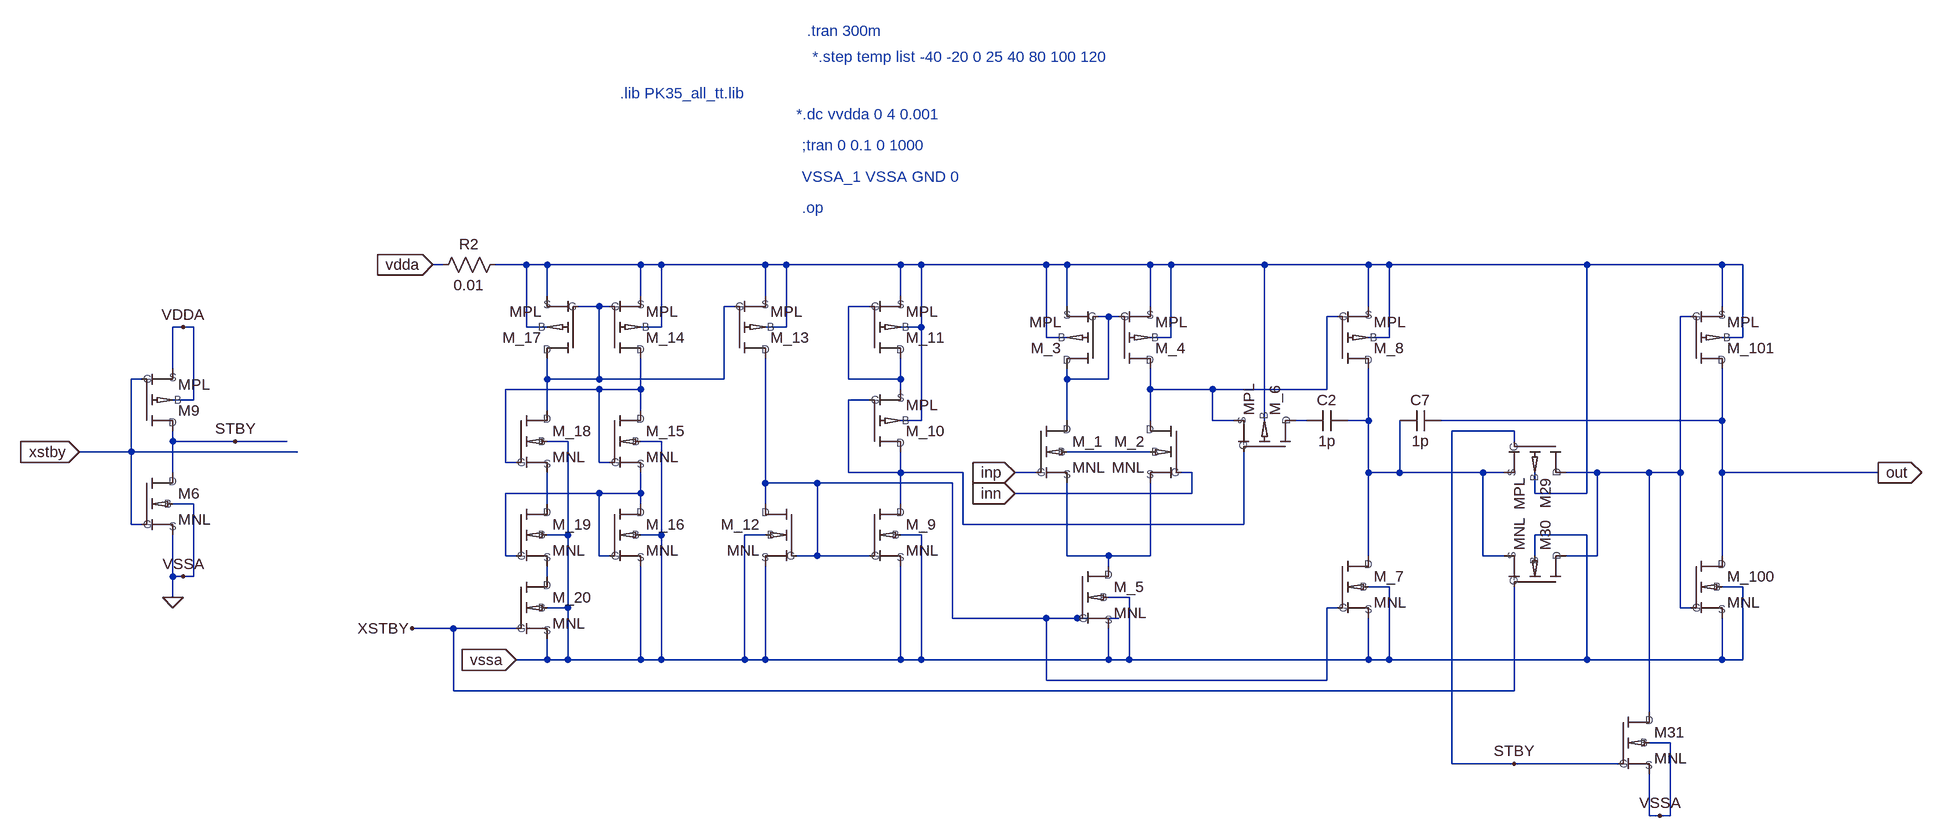
[diagram p0: schematic COMP_NLF_ORIG.asc]
COMP_NLF_ORIG.asc, the LTspice schematic file:
Version 4
SHEET 1 2652 3372
WIRE 192 1408 176 1408
WIRE 320 1408 272 1408
WIRE 352 1408 320 1408
WIRE 496 1408 352 1408
WIRE 528 1408 496 1408
WIRE 688 1408 528 1408
WIRE 720 1408 688 1408
WIRE 896 1408 720 1408
WIRE 928 1408 896 1408
WIRE 1120 1408 928 1408
WIRE 1152 1408 1120 1408
WIRE 1280 1408 1152 1408
WIRE 1312 1408 1280 1408
WIRE 1456 1408 1312 1408
WIRE 1616 1408 1456 1408
WIRE 1648 1408 1616 1408
WIRE 1952 1408 1648 1408
WIRE 2160 1408 1952 1408
WIRE 2192 1408 2160 1408
WIRE 352 1456 352 1408
WIRE 496 1456 496 1408
WIRE 688 1456 688 1408
WIRE 896 1456 896 1408
WIRE 432 1472 400 1472
WIRE 448 1472 432 1472
WIRE 640 1472 624 1472
WIRE 848 1472 816 1472
WIRE 1152 1472 1152 1408
WIRE 1280 1472 1280 1408
WIRE 1616 1472 1616 1408
WIRE 2160 1472 2160 1408
WIRE 1216 1488 1200 1488
WIRE 1232 1488 1216 1488
WIRE 1568 1488 1552 1488
WIRE 2112 1488 2096 1488
WIRE -208 1504 -224 1504
WIRE -192 1504 -208 1504
WIRE 320 1504 320 1408
WIRE 352 1504 320 1504
WIRE 528 1504 528 1408
WIRE 528 1504 496 1504
WIRE 720 1504 720 1408
WIRE 720 1504 688 1504
WIRE 928 1504 928 1408
WIRE 928 1504 896 1504
WIRE 1120 1520 1120 1408
WIRE 1152 1520 1120 1520
WIRE 1312 1520 1312 1408
WIRE 1312 1520 1280 1520
WIRE 1648 1520 1648 1408
WIRE 1648 1520 1616 1520
WIRE 2192 1520 2192 1408
WIRE 2192 1520 2160 1520
WIRE -224 1568 -224 1504
WIRE -272 1584 -288 1584
WIRE 352 1584 352 1552
WIRE 432 1584 432 1472
WIRE 432 1584 352 1584
WIRE 624 1584 624 1472
WIRE 624 1584 432 1584
WIRE 816 1584 816 1472
WIRE 896 1584 896 1552
WIRE 896 1584 816 1584
WIRE 1152 1584 1152 1568
WIRE 1216 1584 1216 1488
WIRE 1216 1584 1152 1584
WIRE 432 1600 288 1600
WIRE 496 1600 496 1552
WIRE 496 1600 432 1600
WIRE 896 1600 896 1584
WIRE 1280 1600 1280 1568
WIRE 1376 1600 1280 1600
WIRE 1552 1600 1552 1488
WIRE 1552 1600 1376 1600
WIRE -192 1616 -192 1504
WIRE -192 1616 -224 1616
WIRE 848 1616 816 1616
WIRE 352 1632 352 1584
WIRE 496 1632 496 1600
WIRE 928 1648 928 1504
WIRE 928 1648 896 1648
WIRE 1152 1648 1152 1584
WIRE 1280 1648 1280 1600
WIRE 1376 1648 1376 1600
WIRE 1408 1648 1376 1648
WIRE 1456 1648 1456 1408
WIRE 1520 1648 1504 1648
WIRE 1616 1648 1616 1568
WIRE 1616 1648 1584 1648
WIRE 2160 1648 2160 1568
WIRE 2160 1648 1728 1648
WIRE 1840 1664 1744 1664
WIRE -224 1680 -224 1664
WIRE -128 1680 -224 1680
WIRE -48 1680 -128 1680
WIRE 384 1680 352 1680
WIRE 528 1680 496 1680
WIRE 1840 1680 1840 1664
WIRE -288 1696 -288 1584
WIRE -288 1696 -368 1696
WIRE -32 1696 -288 1696
WIRE 1280 1696 1152 1696
WIRE 288 1712 288 1600
WIRE 304 1712 288 1712
WIRE 432 1712 432 1600
WIRE 448 1712 432 1712
WIRE -224 1728 -224 1680
WIRE 816 1728 816 1616
WIRE 896 1728 896 1696
WIRE 896 1728 816 1728
WIRE 992 1728 896 1728
WIRE 1104 1728 1072 1728
WIRE 1344 1728 1328 1728
WIRE 1616 1728 1616 1648
WIRE 1664 1728 1664 1648
WIRE 1664 1728 1616 1728
WIRE 1792 1728 1664 1728
WIRE 1824 1728 1792 1728
WIRE 1968 1728 1920 1728
WIRE 2048 1728 1968 1728
WIRE 2096 1728 2096 1488
WIRE 2096 1728 2048 1728
WIRE 2160 1728 2160 1648
WIRE 2400 1728 2160 1728
WIRE 688 1744 688 1552
WIRE 768 1744 688 1744
WIRE 976 1744 768 1744
WIRE 432 1760 288 1760
WIRE 496 1760 496 1728
WIRE 496 1760 432 1760
WIRE 1344 1760 1344 1728
WIRE 1344 1760 1072 1760
WIRE 1872 1760 1872 1728
WIRE 1952 1760 1952 1408
WIRE 1952 1760 1872 1760
WIRE -192 1776 -224 1776
WIRE 352 1776 352 1728
WIRE 496 1776 496 1760
WIRE 688 1776 688 1744
WIRE 896 1776 896 1728
WIRE -288 1808 -288 1696
WIRE -272 1808 -288 1808
WIRE 992 1808 992 1728
WIRE 1424 1808 1424 1696
WIRE 1424 1808 992 1808
WIRE 384 1824 384 1680
WIRE 384 1824 352 1824
WIRE 528 1824 528 1680
WIRE 528 1824 496 1824
WIRE 688 1824 656 1824
WIRE 928 1824 896 1824
WIRE 1952 1824 1872 1824
WIRE 288 1856 288 1760
WIRE 304 1856 288 1856
WIRE 432 1856 432 1760
WIRE 448 1856 432 1856
WIRE 768 1856 768 1744
WIRE 768 1856 736 1856
WIRE 848 1856 768 1856
WIRE 1152 1856 1152 1744
WIRE 1216 1856 1152 1856
WIRE 1280 1856 1280 1744
WIRE 1280 1856 1216 1856
WIRE 1616 1856 1616 1728
WIRE 1792 1856 1792 1728
WIRE 1824 1856 1792 1856
WIRE 1872 1856 1872 1824
WIRE 1968 1856 1968 1728
WIRE 1968 1856 1920 1856
WIRE 2160 1856 2160 1728
WIRE 1216 1872 1216 1856
WIRE -224 1888 -224 1824
WIRE -208 1888 -224 1888
WIRE -192 1888 -192 1776
WIRE -192 1888 -208 1888
WIRE 352 1888 352 1872
WIRE 1648 1904 1616 1904
WIRE 2192 1904 2160 1904
WIRE -224 1920 -224 1888
WIRE 1248 1920 1216 1920
WIRE 384 1936 384 1824
WIRE 384 1936 352 1936
WIRE 1568 1936 1552 1936
WIRE 2096 1936 2096 1728
WIRE 2112 1936 2096 1936
WIRE 976 1952 976 1744
WIRE 1120 1952 976 1952
WIRE 1168 1952 1120 1952
WIRE 1232 1952 1168 1952
WIRE 208 1968 144 1968
WIRE 304 1968 208 1968
WIRE 352 2016 352 1984
WIRE 352 2016 304 2016
WIRE 384 2016 384 1936
WIRE 384 2016 352 2016
WIRE 496 2016 496 1872
WIRE 496 2016 384 2016
WIRE 528 2016 528 1824
WIRE 528 2016 496 2016
WIRE 656 2016 656 1824
WIRE 656 2016 528 2016
WIRE 688 2016 688 1872
WIRE 688 2016 656 2016
WIRE 896 2016 896 1872
WIRE 896 2016 688 2016
WIRE 928 2016 928 1824
WIRE 928 2016 896 2016
WIRE 1216 2016 1216 1968
WIRE 1216 2016 928 2016
WIRE 1248 2016 1248 1920
WIRE 1248 2016 1216 2016
WIRE 1616 2016 1616 1952
WIRE 1616 2016 1248 2016
WIRE 1648 2016 1648 1904
WIRE 1648 2016 1616 2016
WIRE 1952 2016 1952 1824
WIRE 1952 2016 1648 2016
WIRE 2160 2016 2160 1952
WIRE 2160 2016 1952 2016
WIRE 2192 2016 2192 1904
WIRE 2192 2016 2160 2016
WIRE 1120 2048 1120 1952
WIRE 1552 2048 1552 1936
WIRE 1552 2048 1120 2048
WIRE 208 2064 208 1968
WIRE 1840 2064 1840 1904
WIRE 1840 2064 208 2064
WIRE 2048 2096 2048 1728
WIRE 2080 2144 2048 2144
WIRE 1744 2176 1744 1664
WIRE 1840 2176 1744 2176
WIRE 2000 2176 1840 2176
WIRE 2048 2256 2048 2192
WIRE 2064 2256 2048 2256
WIRE 2080 2256 2080 2144
WIRE 2080 2256 2064 2256
FLAG -368 1696 xstby
IOPIN -368 1696 In
FLAG -208 1504 VDDA
FLAG -208 1888 VSSA
FLAG 1072 1760 inn
IOPIN 1072 1760 In
FLAG 1072 1728 inp
IOPIN 1072 1728 In
FLAG 2400 1728 out
IOPIN 2400 1728 Out
FLAG 176 1408 vdda
IOPIN 176 1408 In
FLAG 304 2016 vssa
IOPIN 304 2016 In
FLAG 2064 2256 VSSA
FLAG -128 1680 STBY
FLAG 144 1968 XSTBY
FLAG 1840 2176 STBY
FLAG -224 1920 0
SYMBOL MNL -240 1776 R0
SYMATTR InstName M6
SYMATTR SpiceLine l=1.0u w=5.0u pd=w+l+l ps=pd ad=w*l as=ad m=1
SYMBOL MPL -240 1616 M180
SYMATTR InstName M9
SYMATTR SpiceLine l=1.0u w=10.0u pd=w+l+l ps=pd ad=w*l as=ad m=1
SYMBOL MNL 336 1680 R0
SYMATTR InstName M_18
SYMATTR SpiceLine l=1.2u w=10.0u pd=w+l+l ps=pd ad=w*l as=ad m=1
SYMBOL MPL 480 1504 M180
SYMATTR InstName M_14
SYMATTR SpiceLine l=1.2u w=54.0u pd=w+l+l ps=pd ad=w*l as=ad m=2
SYMBOL MPL 368 1504 R180
SYMATTR InstName M_17
SYMATTR SpiceLine l=1.2u w=54.0u pd=w+l+l ps=pd ad=w*l as=ad m=2
SYMBOL MNL 480 1680 R0
SYMATTR InstName M_15
SYMATTR SpiceLine l=1.2u w=10.0u pd=w+l+l ps=pd ad=w*l as=ad m=1
SYMBOL MNL 336 1936 R0
SYMATTR InstName M_20
SYMATTR SpiceLine l=1.2u w=24u pd=w+l+l ps=pd ad=w*l as=ad m=1
SYMBOL MNL 336 1824 R0
SYMATTR InstName M_19
SYMATTR SpiceLine l=1.2u w=30.0u pd=w+l+l ps=pd ad=w*l as=ad m=1
SYMBOL MNL 480 1824 R0
SYMATTR InstName M_16
SYMATTR SpiceLine l=1.2u w=30.0u pd=w+l+l ps=pd ad=w*l as=ad m=1
SYMBOL MPL 1264 1520 M180
SYMATTR InstName M_4
SYMATTR SpiceLine l=1.2u w=36.0u pd=w+l+l ps=pd ad=w*l as=ad m=1
SYMBOL MNL 1200 1920 R0
SYMATTR InstName M_5
SYMATTR SpiceLine l=1.2u w=54.0u pd=w+l+l ps=pd ad=w*l as=ad m=1
SYMBOL MPL 1600 1520 M180
SYMATTR InstName M_8
SYMATTR SpiceLine l=1.2u w=40.0u pd=w+l+l ps=pd ad=w*l as=ad m=6
SYMBOL MNL 1600 1904 R0
SYMATTR InstName M_7
SYMATTR SpiceLine l=1.2u w=90.08u pd=w+l+l ps=pd ad=w*l as=ad m=2
SYMBOL MNL 2144 1904 R0
SYMATTR InstName M_100
SYMATTR SpiceLine l=1.2u w=90.0u pd=w+l+l ps=pd ad=w*l as=ad m=2
SYMBOL MPL 2144 1520 M180
SYMATTR InstName M_101
SYMATTR SpiceLine l=1.2u w=40.0u pd=w+l+l ps=pd ad=w*l as=ad m=6
SYMBOL cap 1584 1632 R90
WINDOW 0 0 32 VBottom 2
WINDOW 3 32 32 VTop 2
SYMATTR InstName C2
SYMATTR Value 1p
SYMBOL cap 1728 1632 R90
WINDOW 0 0 32 VBottom 2
WINDOW 3 32 32 VTop 2
SYMATTR InstName C7
SYMATTR Value 1p
SYMBOL MPL 1872 1712 R90
SYMATTR InstName M29
SYMATTR SpiceLine l=1.0u w=20.0u pd=w+l+l ps=pd ad=w*l as=ad m=1
SYMBOL MNL 1872 1872 M270
SYMATTR InstName M30
SYMATTR SpiceLine l=1.0u w=12.u pd=w+l+l ps=pd ad=w*l as=ad m=1
SYMBOL MNL 2032 2144 R0
SYMATTR InstName M31
SYMATTR SpiceLine l=1.0u w=12.u pd=w+l+l ps=pd ad=w*l as=ad m=1
SYMBOL MPL 672 1504 M180
SYMATTR InstName M_13
SYMATTR SpiceLine l=1.2u w=54.0u pd=w+l+l ps=pd ad=w*l as=ad m=1
SYMBOL MPL 880 1504 M180
SYMATTR InstName M_11
SYMATTR SpiceLine l=1.2u w=72.0u pd=w+l+l ps=pd ad=w*l as=ad m=1
SYMBOL MPL 880 1648 M180
SYMATTR InstName M_10
SYMATTR SpiceLine l=1.2u w=72.0u pd=w+l+l ps=pd ad=w*l as=ad m=1
SYMBOL MNL 704 1824 M0
SYMATTR InstName M_12
SYMATTR SpiceLine l=1.2u w=54.0u pd=w+l+l ps=pd ad=w*l as=ad m=1
SYMBOL MNL 880 1824 R0
SYMATTR InstName M_9
SYMATTR SpiceLine l=1.2u w=54.0u pd=w+l+l ps=pd ad=w*l as=ad m=1
SYMBOL MNL 1136 1696 R0
SYMATTR InstName M_1
SYMATTR SpiceLine l=1.2u w=6.0u pd=w+l+l ps=pd ad=w*l as=ad m=1
SYMBOL MNL 1296 1696 M0
SYMATTR InstName M_2
SYMATTR SpiceLine l=1.2u w=6.0u pd=w+l+l ps=pd ad=w*l as=ad m=1
SYMBOL MPL 1168 1520 R180
SYMATTR InstName M_3
SYMATTR SpiceLine l=1.2u w=36.0u pd=w+l+l ps=pd ad=w*l as=ad m=1
SYMBOL MPL 1456 1664 M270
SYMATTR InstName M_6
SYMATTR SpiceLine l=1.2u w=55.0u pd=w+l+l ps=pd ad=w*l as=ad m=1
SYMBOL res 288 1392 R90
WINDOW 0 0 56 VBottom 2
WINDOW 3 32 56 VTop 2
SYMATTR InstName R2
SYMATTR Value 0.01
TEXT 744 1224 Left 2 ;;tran 0 0.1 0 1000
TEXT 736 1176 Left 2 ;*.dc vvdda 0 4 0.001
TEXT 760 1088 Left 2 ;*.step temp list -40 -20 0 25 40 80 100 120
TEXT 744 1320 Left 2 ;.op
TEXT 464 1144 Left 2 ;.lib PK35_all_tt.lib
TEXT 752 1048 Left 2 ;.tran 300m
TEXT 744 1272 Left 2 ;VSSA_1 VSSA GND 0

The netlist it stands for:
* COMP_NLF_ORIG.asc
XM6 STBY xstby 0 0 MNL l=1.0u w=5.0u pd=w+l+l ps=pd ad=w*l as=ad m=1  ; pins D G S B
XM9 STBY xstby VDDA VDDA MPL l=1.0u w=10.0u pd=w+l+l ps=pd ad=w*l as=ad m=1  ; pins D G S B
XM_18 N002 N007 N014 0 MNL l=1.2u w=10.0u pd=w+l+l ps=pd ad=w*l as=ad m=1  ; pins D G S B
XM_14 N007 N002 N001 N001 MPL l=1.2u w=54.0u pd=w+l+l ps=pd ad=w*l as=ad m=2  ; pins D G S B
XM_17 N002 N002 N001 N001 MPL l=1.2u w=54.0u pd=w+l+l ps=pd ad=w*l as=ad m=2  ; pins D G S B
XM_15 N007 N007 N013 0 MNL l=1.2u w=10.0u pd=w+l+l ps=pd ad=w*l as=ad m=1  ; pins D G S B
XM_20 N016 xstby 0 0 MNL l=1.2u w=24u pd=w+l+l ps=pd ad=w*l as=ad m=1  ; pins D G S B
XM_19 N014 N013 N016 0 MNL l=1.2u w=30.0u pd=w+l+l ps=pd ad=w*l as=ad m=1  ; pins D G S B
XM_16 N013 N013 0 0 MNL l=1.2u w=30.0u pd=w+l+l ps=pd ad=w*l as=ad m=1  ; pins D G S B
XM_4 N005 N004 N001 N001 MPL l=1.2u w=36.0u pd=w+l+l ps=pd ad=w*l as=ad m=1  ; pins D G S B
XM_5 N015 N012 0 0 MNL l=1.2u w=54.0u pd=w+l+l ps=pd ad=w*l as=ad m=1  ; pins D G S B
XM_8 N010 N005 N001 N001 MPL l=1.2u w=40.0u pd=w+l+l ps=pd ad=w*l as=ad m=6  ; pins D G S B
XM_7 N010 N012 0 0 MNL l=1.2u w=90.08u pd=w+l+l ps=pd ad=w*l as=ad m=2  ; pins D G S B
XM_100 out N006 0 0 MNL l=1.2u w=90.0u pd=w+l+l ps=pd ad=w*l as=ad m=2  ; pins D G S B
XM_101 out N006 N001 N001 MPL l=1.2u w=40.0u pd=w+l+l ps=pd ad=w*l as=ad m=6  ; pins D G S B
C2 N010 N009 1p
C7 out N010 1p
XM29 N006 STBY N010 N001 MPL l=1.0u w=20.0u pd=w+l+l ps=pd ad=w*l as=ad m=1  ; pins D G S B
XM30 N006 xstby N010 0 MNL l=1.0u w=12.u pd=w+l+l ps=pd ad=w*l as=ad m=1  ; pins D G S B
XM31 N006 STBY 0 0 MNL l=1.0u w=12.u pd=w+l+l ps=pd ad=w*l as=ad m=1  ; pins D G S B
XM_13 N012 N002 N001 N001 MPL l=1.2u w=54.0u pd=w+l+l ps=pd ad=w*l as=ad m=1  ; pins D G S B
XM_11 N003 N003 N001 N001 MPL l=1.2u w=72.0u pd=w+l+l ps=pd ad=w*l as=ad m=1  ; pins D G S B
XM_10 N008 N008 N003 N001 MPL l=1.2u w=72.0u pd=w+l+l ps=pd ad=w*l as=ad m=1  ; pins D G S B
XM_12 N012 N012 0 0 MNL l=1.2u w=54.0u pd=w+l+l ps=pd ad=w*l as=ad m=1  ; pins D G S B
XM_9 N008 N012 0 0 MNL l=1.2u w=54.0u pd=w+l+l ps=pd ad=w*l as=ad m=1  ; pins D G S B
XM_1 N004 inp N015 N011 MNL l=1.2u w=6.0u pd=w+l+l ps=pd ad=w*l as=ad m=1  ; pins D G S B
XM_2 N005 inn N015 N011 MNL l=1.2u w=6.0u pd=w+l+l ps=pd ad=w*l as=ad m=1  ; pins D G S B
XM_3 N004 N004 N001 N001 MPL l=1.2u w=36.0u pd=w+l+l ps=pd ad=w*l as=ad m=1  ; pins D G S B
XM_6 N009 N008 N005 N001 MPL l=1.2u w=55.0u pd=w+l+l ps=pd ad=w*l as=ad m=1  ; pins D G S B
R2 N001 VDDA 0.01
* ;tran 0 0.1 0 1000
* *.dc vvdda 0 4 0.001
* *.step temp list -40 -20 0 25 40 80 100 120
* .op
* .lib PK35_all_tt.lib
* .tran 300m
* VSSA_1 VSSA GND 0
.backanno
.end